# EAGLE design LPC_2TE_3.3_LED (EAGLE 5.00)
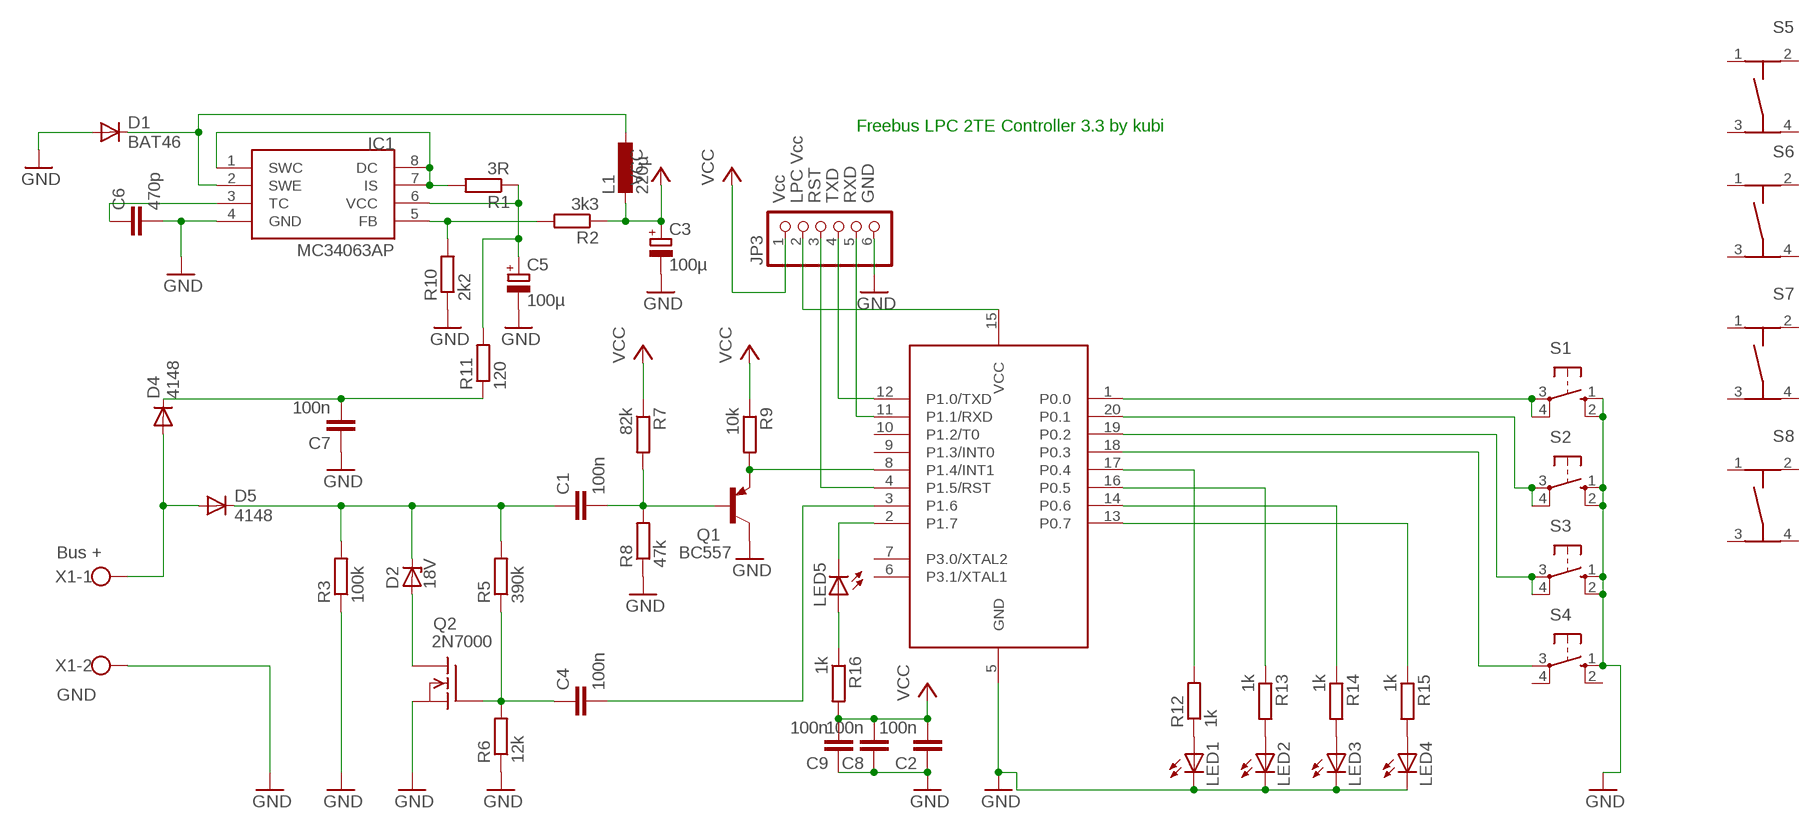
[diagram p0: schematic, sheet 1]

## Parts
C1  100n  C-EU050-024X044  [C050-024X044]
C2  100n  C-EU050-024X044  [C050-024X044]
C3  100µ  CPOL-EUE3.5-8  [E3,5-8]
C4  100n  C-EU050-024X044  [C050-024X044]
C5  100µ  CPOL-EUE3.5-8  [E3,5-8]
C6  470p  C-EU025-024X044  [C025-024X044]
C7  100n  C-EU050-024X044  [C050-024X044]
C8  100n  C-EU050-024X044  [C050-024X044]
C9  100n  C-EU050-024X044  [C050-024X044]
D1  BAT46  BAT81  [DO34-7]
D2  18V  BZX85ZDIOV  [ZDIO-2.5]
D4  4148  1N41481448V  [D-2.5]
D5  4148  1N41481448V  [D-2.5]
IC1  MC34063AP  [DIL08]
JP3  PINHD-1X6  [1X06]
L1  220µ  L-EU0207/2V  [0207/2V@2]
LED1  LED3MM  [LED3MM]
LED2  LED3MM  [LED3MM]
LED3  LED3MM  [LED3MM]
LED4  LED3MM  [LED3MM]
LED5  LED3MM  [LED3MM]
Q1  BC557  [TO92]
Q2  2N7000  VN2222KM  [TO237]
R1  3R  R-EU_0207/2V  [0207/2V]
R2  3k3  R-EU_0207/2V  [0207/2V]
R3  100k  R-EU_0207/2V  [0207/2V]
R5  390k  R-EU_0207/2V  [0207/2V]
R6  12k  R-EU_0207/2V  [0207/2V]
R7  82k  R-EU_0207/2V  [0207/2V]
R8  47k  R-EU_0204/7  [0204/7]
R9  10k  R-EU_0204/7  [0204/7]
R10  2k2  R-EU_0207/2V  [0207/2V]
R11  120  R-EU_0207/2V  [0207/2V]
R12  1k  R-EU_0207/5V  [0207/5V]
R13  1k  R-EU_0207/2V  [0207/2V]
R14  1k  R-EU_0207/2V  [0207/2V]
R15  1k  R-EU_0207/2V  [0207/2V]
R16  1k  R-EU_0207/12  [0207/12]
S1  10-XX  [B3F-10XX]
S2  10-XX  [B3F-10XX]
S3  10-XX  [B3F-10XX]
S4  10-XX  [B3F-10XX]
S5  TASTER-9314_SMD  [TASTER-9314_SMD]
S6  TASTER-9314_SMD  [TASTER-9314_SMD]
S7  TASTER-9314_SMD  [TASTER-9314_SMD]
S8  TASTER-9314_SMD  [TASTER-9314_SMD]
U1  89LPC922  [DIL20]
X1  W237-102  [W237-102]

## Nets
GND: C2.1 C3.- C5.- C6.2 C7.1 C8.1 C9.1 D1.A IC1.4(GND) JP3.6 LED1.K(C) LED2.K(C) LED3.K(C) LED4.K(C) Q1.3(C) Q2.3(S) R3.1 R6.1 R8.1 R10.1 S1.1(S) S1.2(S1) S2.1(S) S2.2(S1) S3.1(S) S3.2(S1) S4.1(S) U1.5(GND) X1.2
N$1: Q1.1(E) R9.2 U1.8(P1.4/INT1)
N$2: C1.2 Q1.2(B) R7.2 R8.2
N$3: D4.A D5.A X1.1
N$4: C1.1 D2.C D5.C R3.2 R5.2
N$5: C4.2 U1.3(P1.6)
N$6: D2.A Q2.1(D)
N$8: IC1.1(SWC) IC1.7(IS) IC1.8(DC) R1.2
N$10: C5.+ IC1.6(VCC) R1.1 R11.2
N$11: IC1.5(FB) R2.2 R10.2
N$12: D1.C IC1.2(SWE) L1.1
N$13: C7.2 D4.C R11.1
N$14: C6.1 IC1.3(TC)
N$16: LED4.A R15.2
N$17: LED1.A R12.1
N$18: LED2.A R13.2
N$19: LED3.A R14.2
N$20: LED5.A R16.1
N$21: R12.2 U1.17(P0.4)
N$22: R13.1 U1.16(P0.5)
N$23: R14.1 U1.14(P0.6)
N$24: R15.1 U1.13(P0.7)
N$25: LED5.K(C) U1.2(P1.7)
N$29: JP3.4 U1.12(P1.0/TXD)
N$30: JP3.5 U1.11(P1.1/RXD)
N$31: JP3.3 U1.4(P1.5/RST)
N$32: JP3.2 U1.15(VCC)
N$34: C4.1 Q2.2(G) R5.1 R6.2
P0.0: S1.3(P) S1.4(P1) U1.1(P0.0)
P0.1: S2.3(P) S2.4(P1) U1.20(P0.1)
P0.2: S3.3(P) S3.4(P1) U1.19(P0.2)
P0.3: S4.3(P) U1.18(P0.3)
VCC: C2.2 C3.+ C8.2 C9.2 JP3.1 L1.2 R2.1 R7.1 R9.1 R16.2
Unconnected: S4.2(S1) S4.4(P1) S5.1 S5.2 S5.3 S5.4 S6.1 S6.2 S6.3 S6.4 S7.1 S7.2 S7.3 S7.4 S8.1 S8.2 S8.3 S8.4 U1.6(P3.1/XTAL1) U1.7(P3.0/XTAL2) U1.9(P1.3/INT0) U1.10(P1.2/T0)

## Notes on the sheet
- Freebus LPC 2TE Controller 3.3 by kubi
- Vcc | LPC Vcc | RST | TXD | RXD | GND
- Bus +
- GND

## Library data of the parts
C1 C2 C4 C6-C9 = rcl:C-EU: CAPACITOR, European symbol
C3 C5 = rcl:CPOL-EU: POLARIZED CAPACITOR, European symbol
D1 = diode:BAT81: DIODE barrier diode
D2 = diode:BZX85: Z DIODE
D4 D5 = diode:1N4148: DIODE high speed (Philips)
IC1 = mc34063:MC34063
JP3 = pinhead:PINHD-1X6: PIN HEADER
L1 = rcl:L-EU: INDUCTOR, European symbol
LED1-LED5 = led:LED: LED OSRAM: - CHIPLED LG R971, LG N971, LY N971, LG Q971, LY Q971, LO R971, LY R971 LH N974, LH R974 LS Q976, LO Q976, LY Q976 LO Q996 - Hyper CHIPLED LW Q18S LB Q993, LB Q99A, LB R99A - SideLED LS A670, LO A670, LY A670, LG A670, LP A670 LB A673, LV A673, LT A673, LW A673 LH A674 LY A675 LS A676, LA A676, LO A676, LY A676, LW A676 LS A679, LY A679, LG A679 - Hyper Micro SIDELED® LS Y876, LA Y876, LO Y876, LY Y876 LT Y87S - SmartLED LW L88C, LW L88S LB L89C, LB L89S, LG L890 LS L89K, LO L89K, LY L89K LS L896, LA L896, LO L896, LY L896 - TOPLED LS T670, LO T670, LY T670, LG T670, LP T670 LSG T670, LSP T670, LSY T670, LOP T670, LYG T670 LG T671, LOG T671, LSG T671 LB T673, LV T673, LT T673, LW T673 LH T674 LS T676, LA T676, LO T676, LY T676, LB T676, LH T676, LSB T676, LW T676 LB T67C, LV T67C, LT T67C, LS T67K, LO T67K, LY T67K, LW E67C LS E67B, LA E67B, LO E67B, LY E67B, LB E67C, LV E67C, LT E67C LW T67C LS T679, LY T679, LG T679 LS T770, LO T770, LY T770, LG T770, LP T770 LB T773, LV T773, LT T773, LW T773 LH T774 LS E675, LA E675, LY E675, LS T675 LS T776, LA T776, LO T776, LY T776, LB T776 LHGB T686 LT T68C, LB T68C - Hyper Mini TOPLED® LB M676 - Mini TOPLED Santana® LG M470 LS M47K, LO M47K, LY M47K Source: http://www.osram.convergy.de/
Q1 = transistor-pnp:BC557: PNP Transistor
Q2 = transistor-fet:VN2222KM: N-Channel Enhancement MOSFET (VMOS); 60V; 0,5A; 7,5Ohm
R1-R3 R5-R16 = rcl:R-EU_: RESISTOR, European symbol
S1-S4 = switch-omron:10-XX: OMRON SWITCH
S5-S8 = Ergaenzung:TASTER-9314_SMD
U1 = micro-philips:89LPC922
X1 = con-wago-500:W237-102: WAGO SCREW CLAMP

## Board
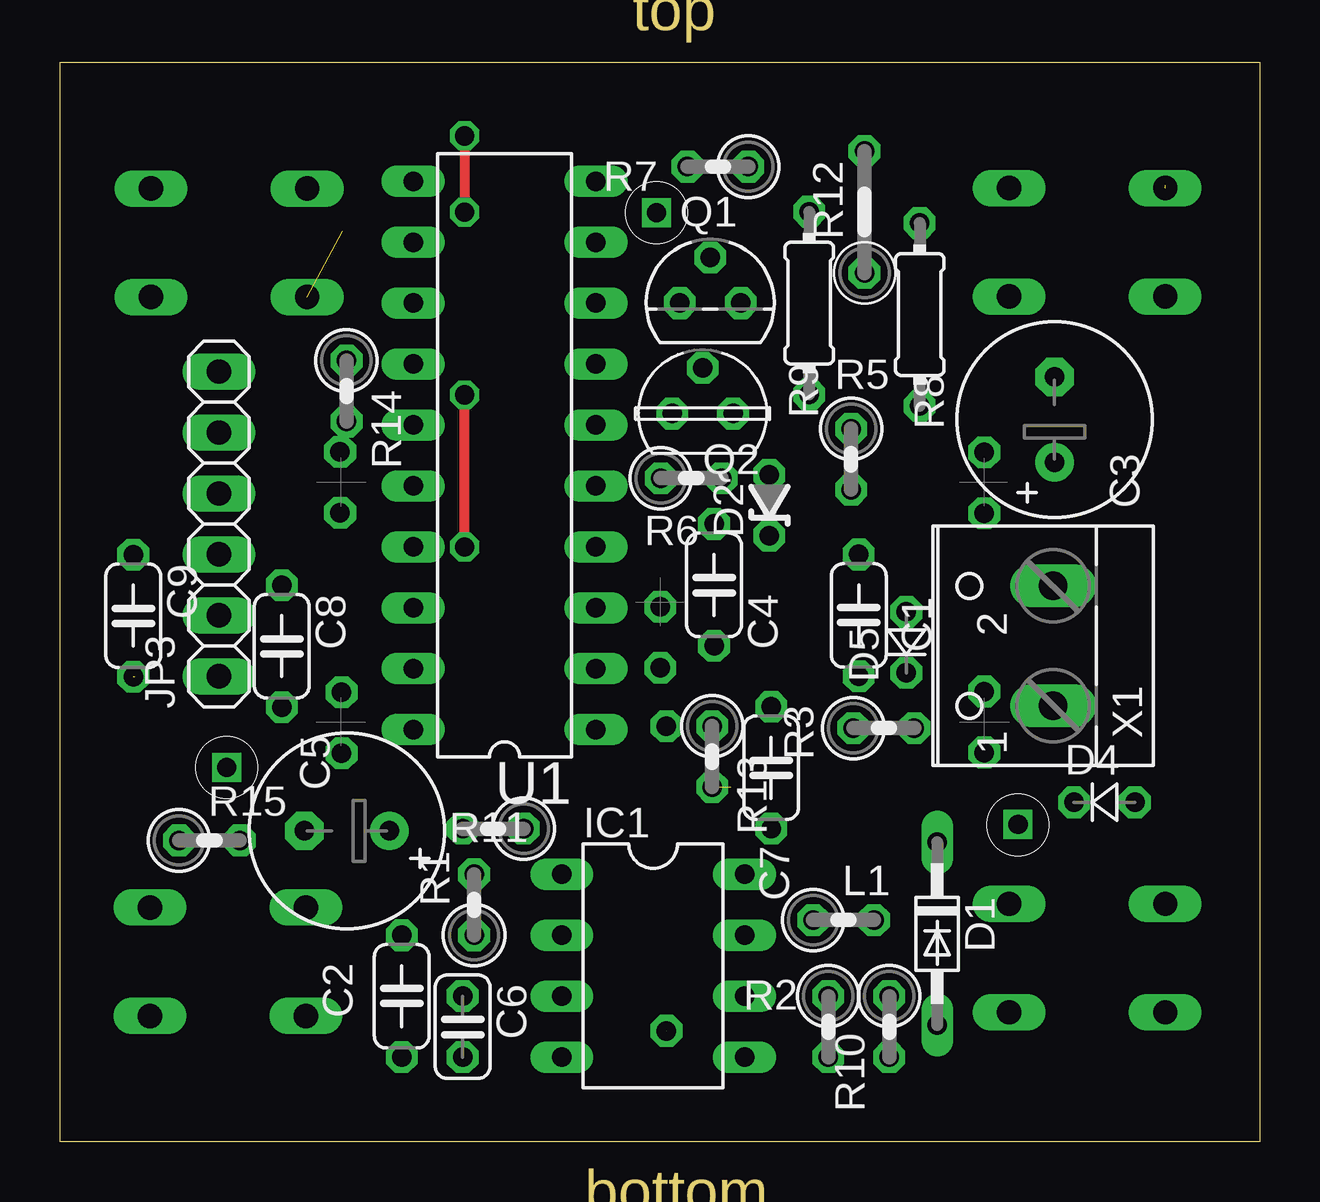
[diagram p1: board, top side]
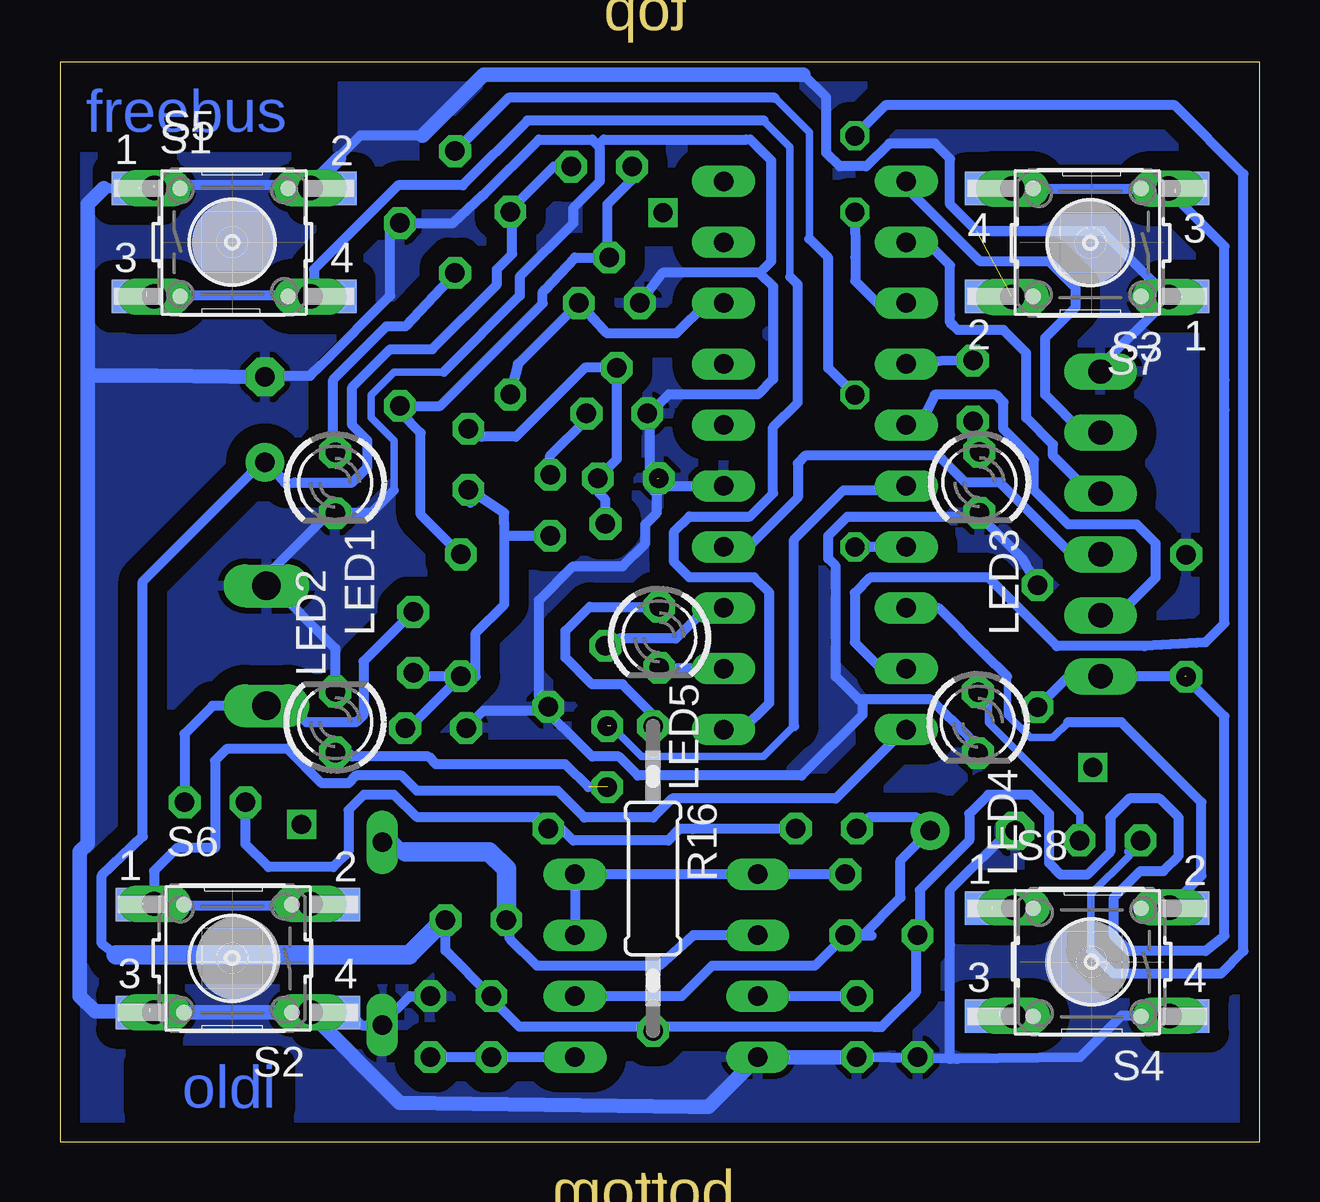
[diagram p2: board, bottom side, seen from below]

Size 50 x 45 mm. Coordinates in mm from the lower left corner, seen from the top.
Outline: 50,0 0,0 0,45 50,45 50,0
Copper layers (1*16): Top 0.035mm / dielectric 1.5mm / Bottom 0.035mm
Design rules "default *": minimum track width 10mil, minimum drill 24mil, track to track 12mil, track to pad 12mil, pad to pad 12mil, via to via 16mil, smd to smd 8mil, copper to edge 20mil, drill to drill 8mil, minimum pad ring 10mil, minimum via ring 8mil, stop-mask expansion 4mil, vias tented up to drill 0mil, thermal gap 10mil
tKeepout: area 16.2,44 to 33.7,45; area 0,0.1 to 4,45; area 0.1,0 to 50,1; area 45.8,0.1 to 50,45; area 39.6,38.3 to 45.9,44.9; area 36.2,41.7 to 39.6,45; area 34.5,43.2 to 36.1,45; area 43,35 to 45.8,38.3; area 44.6,33.4 to 45.8,34.9; area 41.4,36.6 to 42.9,38.2; area 37.9,39.9 to 39.6,41.7; area 40.8,0.8 to 45.9,7.7; 25 more areas; 10 lines
bKeepout: area 18.3,18 to 19.6,21.2; area 30.5,18 to 31.8,27.9; area 45,17.2 to 50,27.2; area 14.8,17.8 to 19.8,27.8; area 30.3,18 to 35.3,28; area 0,17.2 to 5,27.2; area 0,0 to 50,2.8; area 0,42.2 to 50,45; area 22.4,38.3 to 27.4,39.2; area 39.4,11 to 40.5,15.4; area 6.5,13.4 to 7.5,17.8; area 47.8,0 to 50,45; 1 more areas

### Footprints (pad centres in the part's own frame; a part is rotated, then mirrored left to right if it is on the bottom)
C050-024X044 = drill 0.813 octagon: 1 -2.54,0; 2 2.54,0
E3,5-8 = drill 0.813 pad 1.6 round: + -1.778,0 | drill 0.813 pad 1.6 octagon: - 1.778,0
C025-024X044 = drill 0.813 octagon: 1 -1.27,0; 2 1.27,0
DO34-7 = drill 0.813 long: A 3.81,0; C -3.81,0
ZDIO-2.5 = drill 0.813 octagon: A 1.27,0; C -1.27,0
D-2.5 = drill 0.813 octagon: A 1.27,0; C -1.27,0
DIL08 = drill 0.813 long: 1 -3.81,-3.81; 2 -1.27,-3.81; 3 1.27,-3.81; 4 3.81,-3.81; 5 3.81,3.81; 6 1.27,3.81; 7 -1.27,3.81; 8 -3.81,3.81
1X06 = drill 1.016 long: 1 -6.35,0; 2 -3.81,0; 3 -1.27,0; 4 1.27,0; 5 3.81,0; 6 6.35,0
0207/2V@2 = drill 0.813 octagon: 1 -1.27,0; 2 1.27,0
LED3MM = drill 0.813 octagon: A -1.27,0; K 1.27,0
TO92 = drill 0.813 octagon: 1 1.27,0; 2 0,1.905; 3 -1.27,0
TO237 = drill 0.813 octagon: 1 1.27,0; 2 0,1.905; 3 -1.27,0
0207/2V = drill 0.813 octagon: 1 -1.27,0; 2 1.27,0
0204/7 = drill 0.813 octagon: 1 -3.81,0; 2 3.81,0
0207/5V = drill 0.813 octagon: 1 -2.54,0; 2 2.54,0
0207/12 = drill 0.813 octagon: 1 -6.35,0; 2 6.35,0
B3F-10XX = drill 1.016 long: 1 -3.251,2.261; 2 3.251,2.261; 3 -3.251,-2.261; 4 3.251,-2.261
TASTER-9314_SMD = smd 2.1 x 1.4: 1 -4.048,2.25; 2 4.048,2.25; 3 -4.048,-2.25; 4 4.048,-2.25
DIL20 = drill 0.813 long: 1 -11.43,-3.81; 2 -8.89,-3.81; 3 -6.35,-3.81; 4 -3.81,-3.81; 5 -1.27,-3.81; 6 1.27,-3.81; 7 3.81,-3.81; 8 6.35,-3.81; 9 8.89,-3.81; 10 11.43,-3.81; 11 11.43,3.81; 12 8.89,3.81; 13 6.35,3.81; 14 3.81,3.81; 15 1.27,3.81; 16 -1.27,3.81; 17 -3.81,3.81; 18 -6.35,3.81; 19 -8.89,3.81; 20 -11.43,3.81
W237-102 = drill 1.194 long: 1 -2.5,-1.27; 2 2.5,-1.27

### Placement (x,y rotation side)
C1  33.29,21.94 90 top
C2  14.24,6.07 90 top
C3  41.46,30.1 90 top
C4  27.26,23.21 270 top
C5  11.96,12.96 180 top
C6  16.79,4.8 270 top
C7  29.64,15.59 270 top
C8  9.24,20.66 270 top
C9  3.05,21.93 270 top
D1  36.56,8.67 270 top
D2  [ZDIO-2.5]  29.57,26.53 90 top
D4  43.53,14.15 0 top
D5  35.28,20.82 90 top
IC1  24.72,7.34 270 top
JP3  6.63,25.75 90 top
L1  32.66,9.24 0 top
LED1  38.53,27.47 270 bottom
LED2  38.53,17.5 90 bottom
LED3  11.68,27.49 270 bottom
LED4  11.74,17.47 270 bottom
LED5  25.02,21.03 270 bottom
Q1  27.1,34.96 0 top
Q2  26.79,30.36 0 top
R1  17.26,9.88 90 top
R2  32.02,4.8 270 top
R3  34.34,17.25 0 top
R5  32.98,28.45 270 top
R6  26.31,27.66 0 top
R7  27.42,40.65 180 top
R8  35.84,34.48 270 top
R9  31.23,34.96 270 top
R10  34.56,4.8 270 top
R11  18.06,13.05 180 top
R12  33.53,38.76 90 top
R13  27.18,16.06 270 top
R14  11.94,31.3 270 top
R15  6.23,12.56 0 top
R16  25.28,10.98 270 bottom
S1  42.82,37.5 0 bottom
S2  42.82,7.65 180 bottom
S3  7.05,37.47 180 bottom
S4  7,7.5 180 bottom
S5  42.74,37.49 0 bottom
S6  42.58,7.64 0 bottom
S7  7.18,37.49 180 bottom
S8  7.18,7.48 0 bottom
U1  18.53,28.61 90 top
X1  40.12,20.67 90 top

### Tracks (layer width: path | path; a pad name or v marks a point on that pad's centre or on a via)
GND  (3 unrouted)
  Bottom 0.305: 34.01,32.09 36.07,32.09 37.03,31.14 37.03,30.18 36.07,29.23 36.07,27.17
  Bottom 0.406: 25.44,30.34 24.63,31.15 20.91,31.15 20.28,31.79 20.28,35.66 20.83,36.22 | 25.44,30.34 Q2.3 | Q1.3 24.88,36.23 20.85,36.23 20.83,36.22 | 19.01,44.48 18.05,43.53 18.05,41.22 17.5,40.66 16.39,40.66 15.44,41.61 13.53,41.61 12.9,40.98 12.9,39.07 11.79,37.96 6.55,37.96 S3.1 3.8,35.15 6.62,32.33 JP3.6 | S4.1 3.76,5.26 5.75,5.26 7.49,3.53 12.6,3.46 | 12.6,3.46 C6.2 | 39.73,39.87 46.08,39.87 | 12.9,8.21 12.9,10.5 10.2,13.2 10.2,13.14 C5.- | 39.57,5.42 39.49,5.5 | C3.- 41.47,31.9 40.84,31.93 39.57,31.93 39.09,32.41 36.23,35.26 36.23,37.96 35.9,37.98 R8.1 35.61,38.29 35.6,38.28 35.42,38.29 33.61,38.29 32.34,39.47 30.04,41.77 27.82,41.77 27.5,41.45 | 48.85,23.3 48.83,23.3 | 12.6,3.46 12.9,3.46 12.9,8.21 | 12.9,8.21 12.91,8.21 | 20.83,36.22 20.36,36.69 20.36,40.91 21.23,41.79 21.4,41.77 27.34,41.77 27.5,41.61 27.5,41.45 | S1.1 46.13,39.76 46.23,39.87 46.34,39.76 48.18,39.76 | 25.44,30.34 25.44,27.33 25.12,27.01 25.11,27.02 R6.1 24.74,27.33 22.36,27.33 U1.5 | LED2.K 38.53,20.57 41.39,23.44 X1.2 41.45,23.49 41.47,23.52 38.85,26.13 38.61,26.13 38.61,26.2 | LED1.K 38.31,26.2 | 38.42,40.95 38.45,40.98 37.49,41.95 34.88,41.95 | 38.42,40.95 | 34.01,32.09 30.84,35.26 30.84,36.06 28.61,38.28 28.61,38.91 27.5,40.03 27.5,41.45 | LED3.K 11.84,26.06 17.18,26.06 17.98,25.26 17.98,24.31 17.66,23.99 17.66,19.39 16.71,18.44 16.55,18.44 | 16.55,18.44 16.55,17.8 19.09,15.26 25.91,15.26 26.71,16.06 27.82,16.06 28.45,16.69 29.57,17.8 29.57,18.12 29.63,18.12 C7.1 29.72,18.05 29.72,17.96 32.36,17.96 R3.1 | 38.61,26.22 38.61,26.2 | 38.61,26.2 LED1.K | 38.61,26.22 LED1.K | 36.07,27.17 37.03,26.22 38.61,26.22
  Bottom 0.406: 16.55,18.44 13.69,18.44 12.1,16.85 11.79,16.21 11.75,16.21 LED4.K | R10.1 35.42,6.07 36.56,4.93 D1.A 37.42,4.86 37.98,5.42 39.57,5.42 | 39.57,5.42 S2.1 | 25.12,27.64 25.12,26.22 25.6,25.74 25.6,24.95 26.55,23.99 28.61,23.99 30.04,22.56 30.04,18.6 29.72,18.28 | S3.2 | C8.1 9.88,24.31 11.63,26.06
  Bottom 0.61: 48.18,39.76 48.85,39.09 48.85,31.94 | 48.85,31.94 48.85,23.3 48.85,12.42 49.17,12.1 49.17,6.07 48.53,5.43 45.99,5.43 46.03,5.39 S2.1 39.68,5.39 39.65,5.43 | 39.65,39.72 39.68,39.76 S1.2 | 39.65,5.43 39.61,5.39 | 39.65,5.43 35.84,1.62 23.77,1.46 22.98,1.46 IC1.4 C6.2 | 39.65,39.72 39.61,39.76 | 39.65,39.72 38.42,40.95 38.38,40.99 | 34.88,41.95 32.34,44.48 19.01,44.48 | 48.85,31.94 45.99,31.94 C3.-
  pour Bottom (isolate 0.813): -0.44,45.74 -0.44,-0.61 50.52,-0.61 50.52,45.58 35.44,45.58
N$1
  Bottom 0.406: U1.8 23.06,34.95 24.31,33.69 27.2,33.69 27.34,33.84 Q1.1 30.91,32.42 R9.2
N$2
  Bottom 0.406: Q1.2 28.53,36.87 29.8,35.5 29.88,35.42 29.88,34.95 34.16,30.67 R8.2 35.77,30.36 34.96,29.55 34.96,26.15 C1.2 | Q1.2 27.18,36.95 | R7.2 26.15,40.11 27.18,39.07 27.18,37.01 27.1,36.93 Q1.2
N$3
  Bottom 0.406: D4.A 44.8,17.01 43.64,18.17 X1.1 41.31,18.57 40.81,18.57 39.73,17.48 37.66,17.48 37.34,17.8 37.34,20.02 D5.A
N$4
  Bottom 0.406: 32.9,27.17 32.96,27.17 R5.2 | 32.9,27.17 32.9,26.63 | R5.2 32.9,27.1 | 33.31,19.39 33.38,19.39 | 33.31,19.39 32.67,19.39 32.67,21.2 31.47,22.41 31.47,25.26 | D5.C 35.28,19.39 33.31,19.39 | 33.31,19.39 C1.1 35.37,17.33 35.6,17.33 35.6,17.26 R3.2 | 32.9,27.17 32.91,27.18 R5.2 | 32.9,27.17 31.48,26.23 31.48,25.75 31.47,25.74 31.47,25.26 | 31.47,25.26 D2.C
N$5
  Bottom 0.406: U1.3 23.04,22.26 24.33,20.98 26.71,20.98 27.2,20.51 C4.2
N$6
  Bottom 0.406: Q2.1 28.06,30.11 29.57,28.6 D2.A
N$7  (via drill 0.8)
  other vias: 24.86,38.73
N$8
  Bottom 0.406: IC1.7 IC1.8 IC1.1 R1.2
N$9  (via drill 0.8)
  other vias: 6.95,15.6
N$10
  Bottom 0.406: IC1.6 24.09,6.07 22.82,7.34 18.53,7.34 R1.1 16.16,8.59 | R11.2 16.3,13.52 14.29,13.52 C5.+ 14.96,11.74 14.96,10.18 16.55,8.59 16.16,8.59 | 16.16,8.59 16.23,8.59
N$11
  Bottom 0.406: IC1.5 R2.2 R10.2
N$12
  Bottom 0.406: IC1.2 23.61,8.61 25.04,7.34 30.12,7.34 31.23,8.45 L1.1 | 35.6,12.09 36.72,13.18 D1.C
  Bottom 0.813: L1.1 31.39,11.37 32.11,12.09 35.6,12.09
N$13
  Bottom 0.406: D4.C 42.27,12.4 41.31,11.45 38.61,11.45 37.98,12.09 37.98,13.83 37.34,14.47 36.07,14.47 35.11,13.53 30.04,13.52 29.64,13.12 C7.2 29.66,13.04 | R11.1 23.62,13.04 24.17,13.04 24.64,12.56 28.61,12.56 29.09,13.04 29.66,13.04 | 29.66,13.04 29.72,13.04
N$14
  Bottom 0.406: C6.1 IC1.3
N$15  (via drill 0.8)
  other vias: 39.94,13.22
N$16
  Bottom 0.305: R15.2 7.5,13.67 11.31,17.48 11.31,18.28
  Bottom 0.406: LED4.A 11.72,18.75 11.31,18.28 | R15.2
N$17
  Bottom 0.406: R12.1 35.6,33.99 36.39,33.99 38.61,31.77 38.61,28.76 LED1.A
N$18  (1 unrouted)
  Top 0.406: R13.2
  Bottom 0.406: 27.98,14.79 28.93,15.74 34.33,15.74 34.65,16.06 37.82,16.06 37.98,16.21 38.51,16.21 LED2.A
N$19
  Bottom 0.406: LED3.A 11.68,28.81 11.97,29.1 R14.2
N$20
  Bottom 0.406: LED5.A 27.93,22.3 28.93,21.29 28.93,20.18 27.82,19.07 26.55,19.07 25.28,17.8 25.28,17.48 R16.1
N$21  (via drill 0.6, 0.8)
  Top 0.406: v16.87,24.79 v16.87,31.14
  Bottom 0.305: 20.2,43.52 18.77,42.09 18.77,37.65
  Bottom 0.406: R12.2 31.31,43.52 20.2,43.52 | 18.77,37.65 17.98,36.85 17.98,32.25 v16.87,31.14 | U1.17 14.79,24.8 14.8,24.79 v16.87,24.79
N$22  (1 unrouted)
  Top 0.406: R13.1
  Bottom 0.305: 19.41,17.33 20.68,16.06 25.75,16.06 27.02,17.33
  Bottom 0.406: U1.16 14.89,27.17 17.34,27.17 18.93,25.58 19.41,25.1 19.41,17.33
N$23
  Bottom 0.406: U1.14 14.66,32.42 14.61,32.53 R14.1
N$24  (via drill 0.8)
  Top 0.406: v16.87,41.93 v16.87,38.76
  Bottom 0.305: 5.44,12.09 5.44,11.93 7.02,10.34 7.02,7.96
  Bottom 0.406: U1.13 15.91,34.95 16.85,35.89 16.85,36.87 v16.87,38.76 | v16.87,41.93 15.6,43.2 3.53,43.2 0.67,40.34 0.67,7.96 1.62,7.01 6.07,7.01 7.02,7.96 | 5.44,12.09 R15.1
N$25
  Bottom 0.406: 24.96,19.72 24.96,19.76 LED5.K | U1.2 24.96,19.72 | 24.96,19.72 24.96,19.71
N$29
  Bottom 0.406: JP3.4 7.04,27.02 8.61,28.6 8.61,29.07 9.72,30.18 9.72,32.88 10.67,33.84 12.58,33.84 12.74,33.99 12.9,34.15 12.9,34.47 12.9,36.53 13.85,37.49 14.8,37.49 14.79,37.5 U1.12
N$30
  Bottom 0.406: U1.11 14.88,39.95 11.63,36.69 8.77,36.69 7.66,35.58 7.66,34.79 8.93,33.52 8.93,31.14 7.34,29.55 6.71,29.55 6.69,29.56 JP3.5
N$31
  Bottom 0.406: JP3.3 7.83,24.48 10.83,27.49 12.26,27.49 13.21,28.44 13.37,28.6 18.93,28.6 19.25,28.28 19.25,26.85 21.31,24.79 22.26,24.79 22.28,24.8 U1.4
N$32
  Bottom 0.406: JP3.2 5.9,21.94 4.32,23.52 4.32,24.95 5.12,25.74 7.97,25.74 9.4,27.17 9.4,28.44 10.67,29.71 10.67,30.82 10.99,31.14 13.53,31.14 14.15,29.88 | 14.15,29.88 14.8,29.87 | 14.15,29.88 U1.15
N$34
  Bottom 0.406: R5.1 33.04,30.04 33.06,30.03 32.42,29.39 30.99,29.39 28.12,32.26 Q2.2 26.79,28.45 R6.2 27.52,27.02 27.26,26.77 C4.1
P0.0
  Bottom 0.305: 20.68,42.57 19.56,41.45 19.56,36.06
  Bottom 0.406: U1.1 21.55,17.18 20.44,18.29 20.44,22.9 21.07,23.53 23.77,23.53 24.41,24.17 24.41,25.44 23.77,26.07 21.23,26.07 20.28,27.02 20.28,29.79 19.25,30.82 19.25,35.74 19.56,36.06 | 39.41,35.26 39.57,35.26 S1.4 39.59,35.26 46.08,35.26 S1.3 | 39.41,35.26 | 39.41,35.26 39.41,36.38 35.91,39.87 33.22,39.87 30.52,42.57 20.68,42.57
P0.1
  Bottom 0.406: U1.20 14.73,17.17 14.8,17.17 17.66,14.31 24.48,14.31 25.28,13.52 28.14,13.52 29.25,14.63 35.12,14.63 35.76,15.26 37.66,15.26 37.98,14.94 39.09,14.94 40.52,16.37 43.06,16.37 43.53,15.9 43.53,12.24 44.65,12.24 45.12,12.24 46.08,11.29 46.08,10.02 46.07,10.02 S2.4 | S2.4 46.02,9.86 45.92,9.86 45.92,10.34 | S2.4 46.08,9.86 39.62,9.86 S2.3
  Bottom 0.61: S2.3 39.68,9.92
P0.2
  Bottom 0.406: 14.47,19.72 U1.19 14.73,19.71 15.75,19.71 16.87,20.82 16.87,22.88 16.23,23.52 11.31,23.52 8.45,20.66 4.8,20.66 2.26,20.82 1.47,21.61 1.47,30.5 1.47,31.77 1.47,37.33 3.85,39.71 | 3.85,39.71 3.82,39.73 S3.3 | S3.4 10.33,39.73 10.36,39.71 3.85,39.71
P0.3
  Bottom 0.305: 7.97,17.48 8.61,16.85 9.56,16.85 10.52,17.8 10.52,19.39
  Bottom 0.406: S4.3 2.42,11.09 2.42,14.15 5.75,17.48 7.97,17.48 | U1.18 14.71,22.25 13.37,22.25 11.47,20.34 10.52,19.39
VCC  (2 unrouted)
  Bottom 0.305: 3.01,19.28 3.05,19.23
  Bottom 0.406: 6.48,19.39 6.23,19.39 | 6.48,19.39 JP3.1 7.96,19.4 C8.2 | 6.48,19.39 3.12,19.39 3.01,19.28 1.47,17.74 1.47,8.59 2.26,7.96 5.44,7.96 6.07,8.59 6.07,10.18 4.96,11.29 4.01,11.29 3.37,11.93 3.37,13.52 4.17,14.31 5.44,14.31 6.23,13.52 6.23,12.09 7.18,11.13 8.29,11.13 8.77,11.61 8.77,13.67 9.56,14.47 11.31,14.47 12.1,13.67 12.1,12.56 14.17,10.5 14.17,8.59 14.23,8.59 C2.2 14.32,8.53 14.32,6.21 15.75,4.78 16.07,4.78 16.07,4.8 | 47.66,7.8 48.26,8.26 48.26,11.11 46.55,12.72 46.55,23.36 41.47,28.44 41.46,28.42 C3.+ 41.36,28.33 | 34,9.24 L1.2 33.93,7.97 R2.1 32.09,6.07 32.11,6.05 30.85,4.8 25.28,4.8 | 41.36,28.33 41.31,28.28 | R9.1 30.91,38.68 | 16.07,4.8 15.83,4.8 | 16.07,4.8 25.28,4.8 | R9.1 31.23,38.84 29.42,40.65 R7.1 | R9.1 31.3,38.77 31.31,38.76 | R9.1 31.17,38.77 31.15,37.01 31.79,36.38 31.79,35.74 34.49,33.04 36.23,33.04 37.82,31.45 37.82,29.87 37.19,29.23 37.19,28.12 37.82,27.49 40.2,27.49 40.57,27.44 41.36,28.33 | 25.28,4.8 R16.2
  Bottom 0.813: 47.66,7.8 35.44,7.8 34,9.24

### Text on the board
Bottom: freebus | oldi
Dimension: top | bottom
tDocu: tiefe hinten 2.84 | tiefe vorne 2.8 | Platine 1.00mm